# EAGLE schematic ir_remote_v2 (EAGLE 9.6.2)
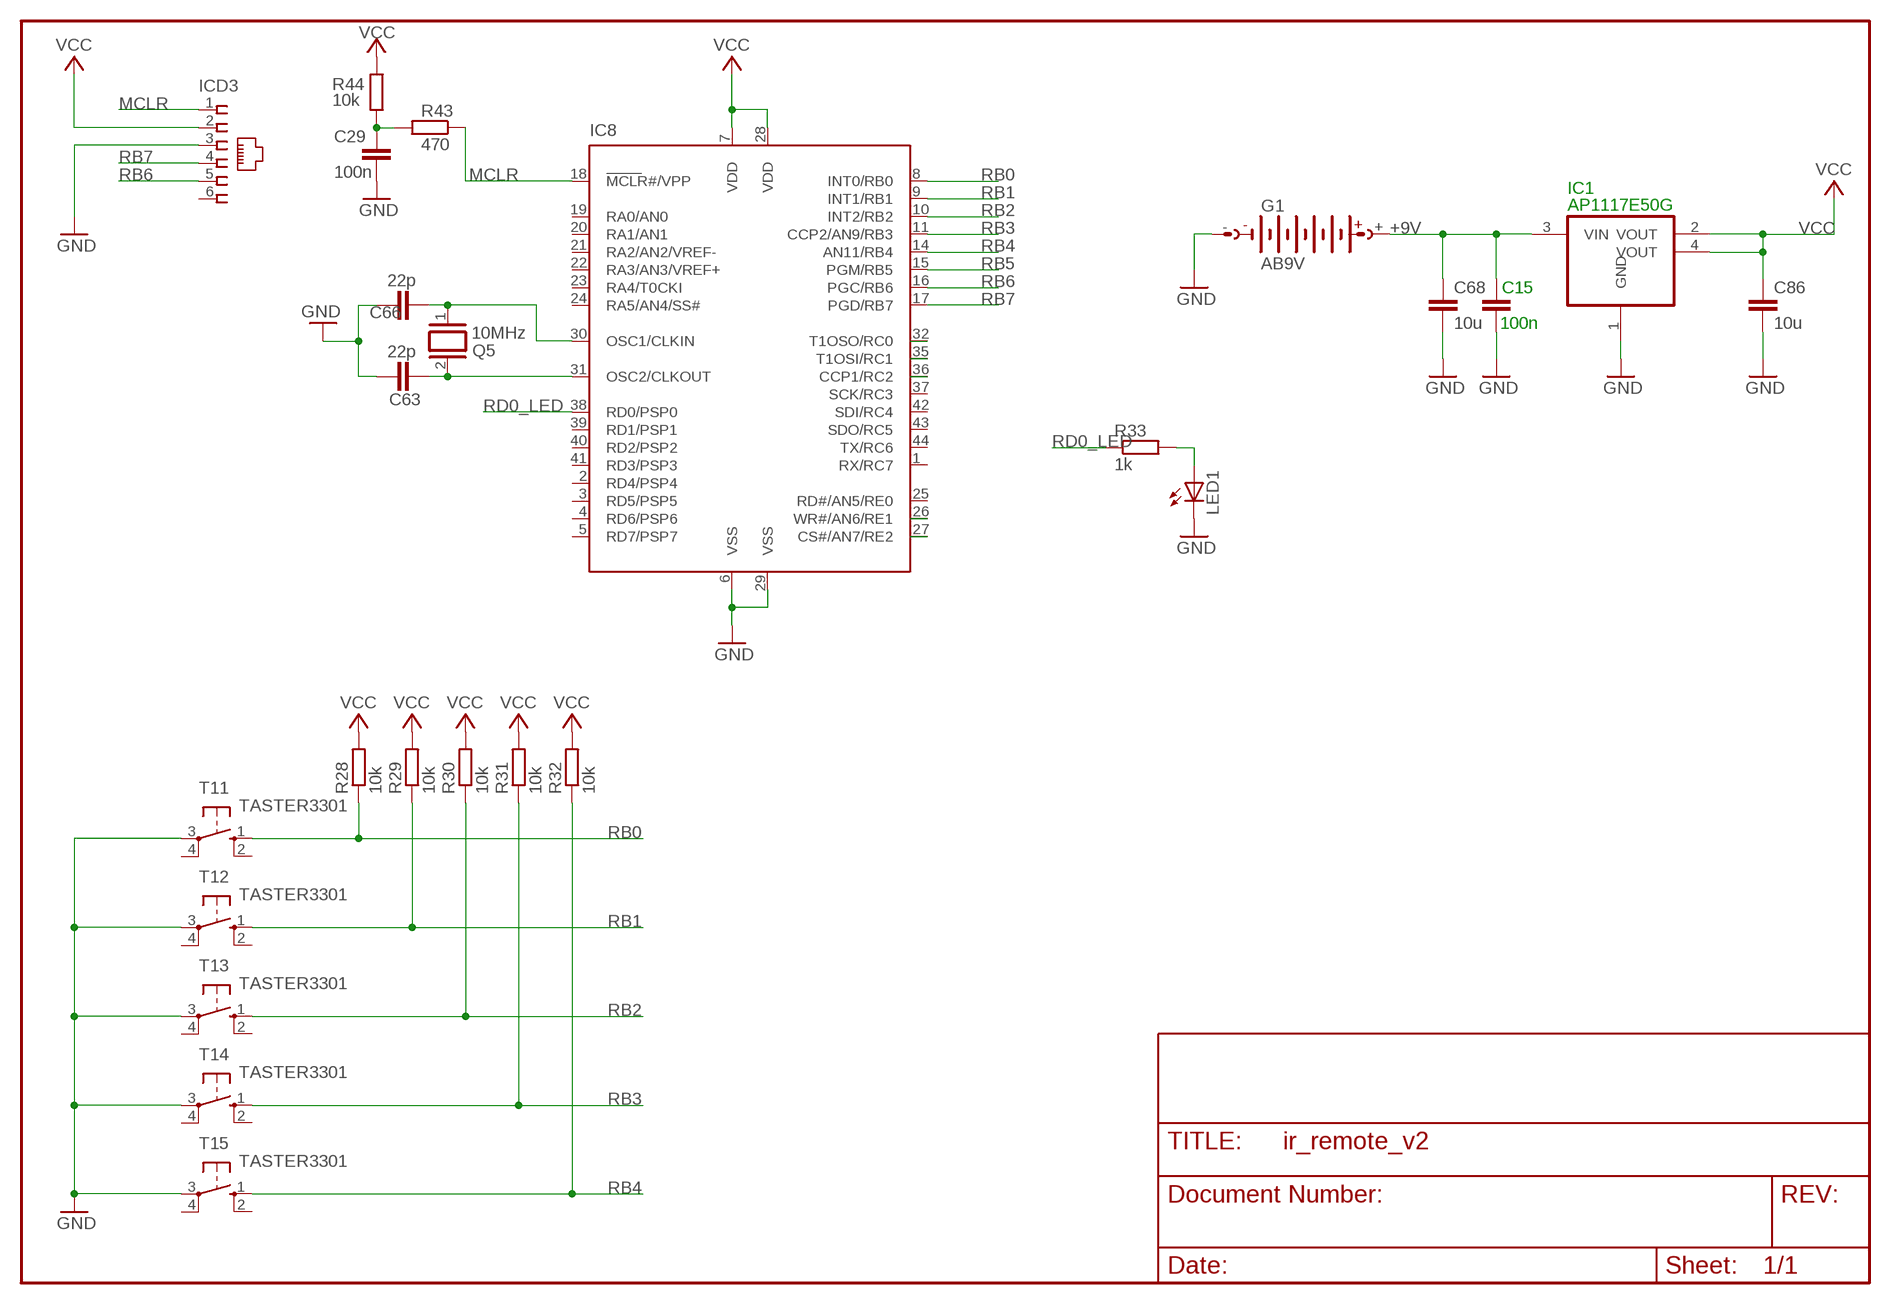
[diagram p0: schematic, sheet 1]

## Parts
C15  100n  C-EUC0805  [C0805]
C29  100n  C-EUC0805  [C0805]
C63  22p  C-EUC0603_WE  [C0603_WE]
C66  22p  C-EUC0603_WE  [C0603_WE]
C68  10u  C-EUC0805  [C0805]
C86  10u  C-EUC0805  [C0805]
G1  AB9V  [AB9V]
IC1  AP1117E50G  REG1117-2OUT  [SOT223]
IC8  PIC18F4520  [TQFP44]
ICD3  520250-3  [520250-3]
LED1  LED5MM  [LED5MM]
Q5  10MHz  XTAL_HC5032  [QUARZ_HC5032/2]
R28  10k  R-EU_0207/7  [0207/7]
R29  10k  R-EU_0207/7  [0207/7]
R30  10k  R-EU_0207/7  [0207/7]
R31  10k  R-EU_0207/7  [0207/7]
R32  10k  R-EU_0207/7  [0207/7]
R33  1k  R-EU_0207/10  [0207/10]
R43  470  R-EU_M0805  [M0805]
R44  10k  R-EU_M0805  [M0805]
T11  TASTER3301  [TASTER3301]
T12  TASTER3301  [TASTER3301]
T13  TASTER3301  [TASTER3301]
T14  TASTER3301  [TASTER3301]
T15  TASTER3301  [TASTER3301]

## Nets
+9V: C15.1 C68.1 G1.+ IC1.3(VIN)
D0_LCD: IC8.27(CS#/AN7/RE2)
D1_LCD: IC8.26(WR#/AN6/RE1)
GND: C15.2 C29.2 C63.1 C66.1 C68.2 C86.2 G1.- IC1.1(GND) IC8.6(VSS) IC8.29(VSS) ICD3.3 LED1.K(C) T11.3(P) T12.3(P) T13.3(P) T14.3(P) T15.3(P)
MCLR: IC8.18(MCLR#/VPP) ICD3.1 R43.1
N$19: LED1.A R33.2
N$24: C29.1 R43.2 R44.2
N$47: C66.2 IC8.30(OSC1/CLKIN) Q5.1
N$48: C63.2 IC8.31(OSC2/CLKOUT) Q5.2
RB0: IC8.8(INT0/RB0) R28.1 T11.1(S)
RB1: IC8.9(INT1/RB1) IC8.35(T1OSI/RC1) R29.1 T12.1(S)
RB2: IC8.10(INT2/RB2) IC8.32(T1OSO/RC0) R30.1 T13.1(S)
RB3: IC8.11(CCP2/AN9/RB3) R31.1 T14.1(S)
RB4: IC8.14(AN11/RB4) R32.1 T15.1(S)
RB5: IC8.15(PGM/RB5)
RB6: IC8.16(PGC/RB6) ICD3.5
RB7: IC8.17(PGD/RB7) ICD3.4
RD0_LED: IC8.38(RD0/PSP0) R33.1
RDS_INT: IC8.36(CCP1/RC2)
VCC: C86.1 IC1.2(VOUT) IC1.4(VOUT) IC8.7(VDD) IC8.28(VDD) ICD3.2 R28.2 R29.2 R30.2 R31.2 R32.2 R44.1
Unconnected: IC8.1(RX/RC7) IC8.2(RD4/PSP4) IC8.3(RD5/PSP5) IC8.4(RD6/PSP6) IC8.5(RD7/PSP7) IC8.19(RA0/AN0) IC8.20(RA1/AN1) IC8.21(RA2/AN2/VREF-) IC8.22(RA3/AN3/VREF+) IC8.23(RA4/T0CKI) IC8.24(RA5/AN4/SS#) IC8.25(RD#/AN5/RE0) IC8.37(SCK/RC3) IC8.39(RD1/PSP1) IC8.40(RD2/PSP2) IC8.41(RD3/PSP3) IC8.42(SDI/RC4) IC8.43(SDO/RC5) IC8.44(TX/RC6) ICD3.6 T11.2(S1) T11.4(P1) T12.2(S1) T12.4(P1) T13.2(S1) T13.4(P1) T14.2(S1) T14.4(P1) T15.2(S1) T15.4(P1)

## Library data of the parts
C15 = rcl_416:C-EU: CAPACITOR, European symbol
C29 C63 C66 C68 C86 = rcl:C-EU: CAPACITOR, European symbol
G1 = battery:AB9V: 9-V BATTERY CLIP
IC1 = Bernd_110428:REG1117-2OUT: 800mA and 1A Low Dropout (LDO) Positive Regulator 1.8V, 2.5V, 2.85V, 3.3V, 5V, and Adj
IC8 = Bernd:PIC18F4520
ICD3 = con-amp:520250-3: AMP connector
LED1 = led:LED: LED OSRAM: - CHIPLED LG R971, LG N971, LY N971, LG Q971, LY Q971, LO R971, LY R971 LH N974, LH R974 LS Q976, LO Q976, LY Q976 LO Q996 - Hyper CHIPLED LW Q18S LB Q993, LB Q99A, LB R99A - SideLED LS A670, LO A670, LY A670, LG A670, LP A670 LB A673, LV A673, LT A673, LW A673 LH A674 LY A675 LS A676, LA A676, LO A676, LY A676, LW A676 LS A679, LY A679, LG A679 - Hyper Micro SIDELED® LS Y876, LA Y876, LO Y876, LY Y876 LT Y87S - SmartLED LW L88C, LW L88S LB L89C, LB L89S, LG L890 LS L89K, LO L89K, LY L89K LS L896, LA L896, LO L896, LY L896 - TOPLED LS T670, LO T670, LY T670, LG T670, LP T670 LSG T670, LSP T670, LSY T670, LOP T670, LYG T670 LG T671, LOG T671, LSG T671 LB T673, LV T673, LT T673, LW T673 LH T674 LS T676, LA T676, LO T676, LY T676, LB T676, LH T676, LSB T676, LW T676 LB T67C, LV T67C, LT T67C, LS T67K, LO T67K, LY T67K, LW E67C LS E67B, LA E67B, LO E67B, LY E67B, LB E67C, LV E67C, LT E67C LW T67C LS T679, LY T679, LG T679 LS T770, LO T770, LY T770, LG T770, LP T770 LB T773, LV T773, LT T773, LW T773 LH T774 LS E675, LA E675, LY E675, LS T675 LS T776, LA T776, LO T776, LY T776, LB T776 LHGB T686 LT T68C, LB T68C - Hyper Mini TOPLED® LB M676 - Mini TOPLED Santana® LG M470 LS M47K, LO M47K, LY M47K Source: http://www.osram.convergy.de LUXEON: - LUMILED® LXK2-PW12-R00, LXK2-PW12-S00, LXK2-PW14-U00, LXK2-PW14-V00 LXK2-PM12-R00, LXK2-PM12-S00, LXK2-PM14-U00 LXK2-PE12-Q00, LXK2-PE12-R00, LXK2-PE12-S00, LXK2-PE14-T00, LXK2-PE14-U00 LXK2-PB12-K00, LXK2-PB12-L00, LXK2-PB12-M00, LXK2-PB14-N00, LXK2-PB14-P00, LXK2-PB14-Q00 LXK2-PR12-L00, LXK2-PR12-M00, LXK2-PR14-Q00, LXK2-PR14-R00 LXK2-PD12-Q00, LXK2-PD12-R00, LXK2-PD12-S00 LXK2-PH12-R00, LXK2-PH12-S00 LXK2-PL12-P00, LXK2-PL12-Q00, LXK2-PL12-R00 Source: www.luxeon.com KINGBRIGHT: KA-3528ASYC Source: www.kingbright.com
Q5 = Bernd:XTAL: 9HT10-32.768KDZF-T RS: 753-7265P Farnell: 2061724
R28-R32 R43 R44 = rcl:R-EU_: RESISTOR, European symbol
R33 = resistor:R-EU_: RESISTOR, European symbol
T11-T15 = Bernd:TASTER3301